# EAGLE design Dock P1RB (EAGLE 8.4.1)
AUTHOR: Simone Mora; CNAME: Tiles Dock; CREVISION: Rev A; DESIGNER: Simone Mora
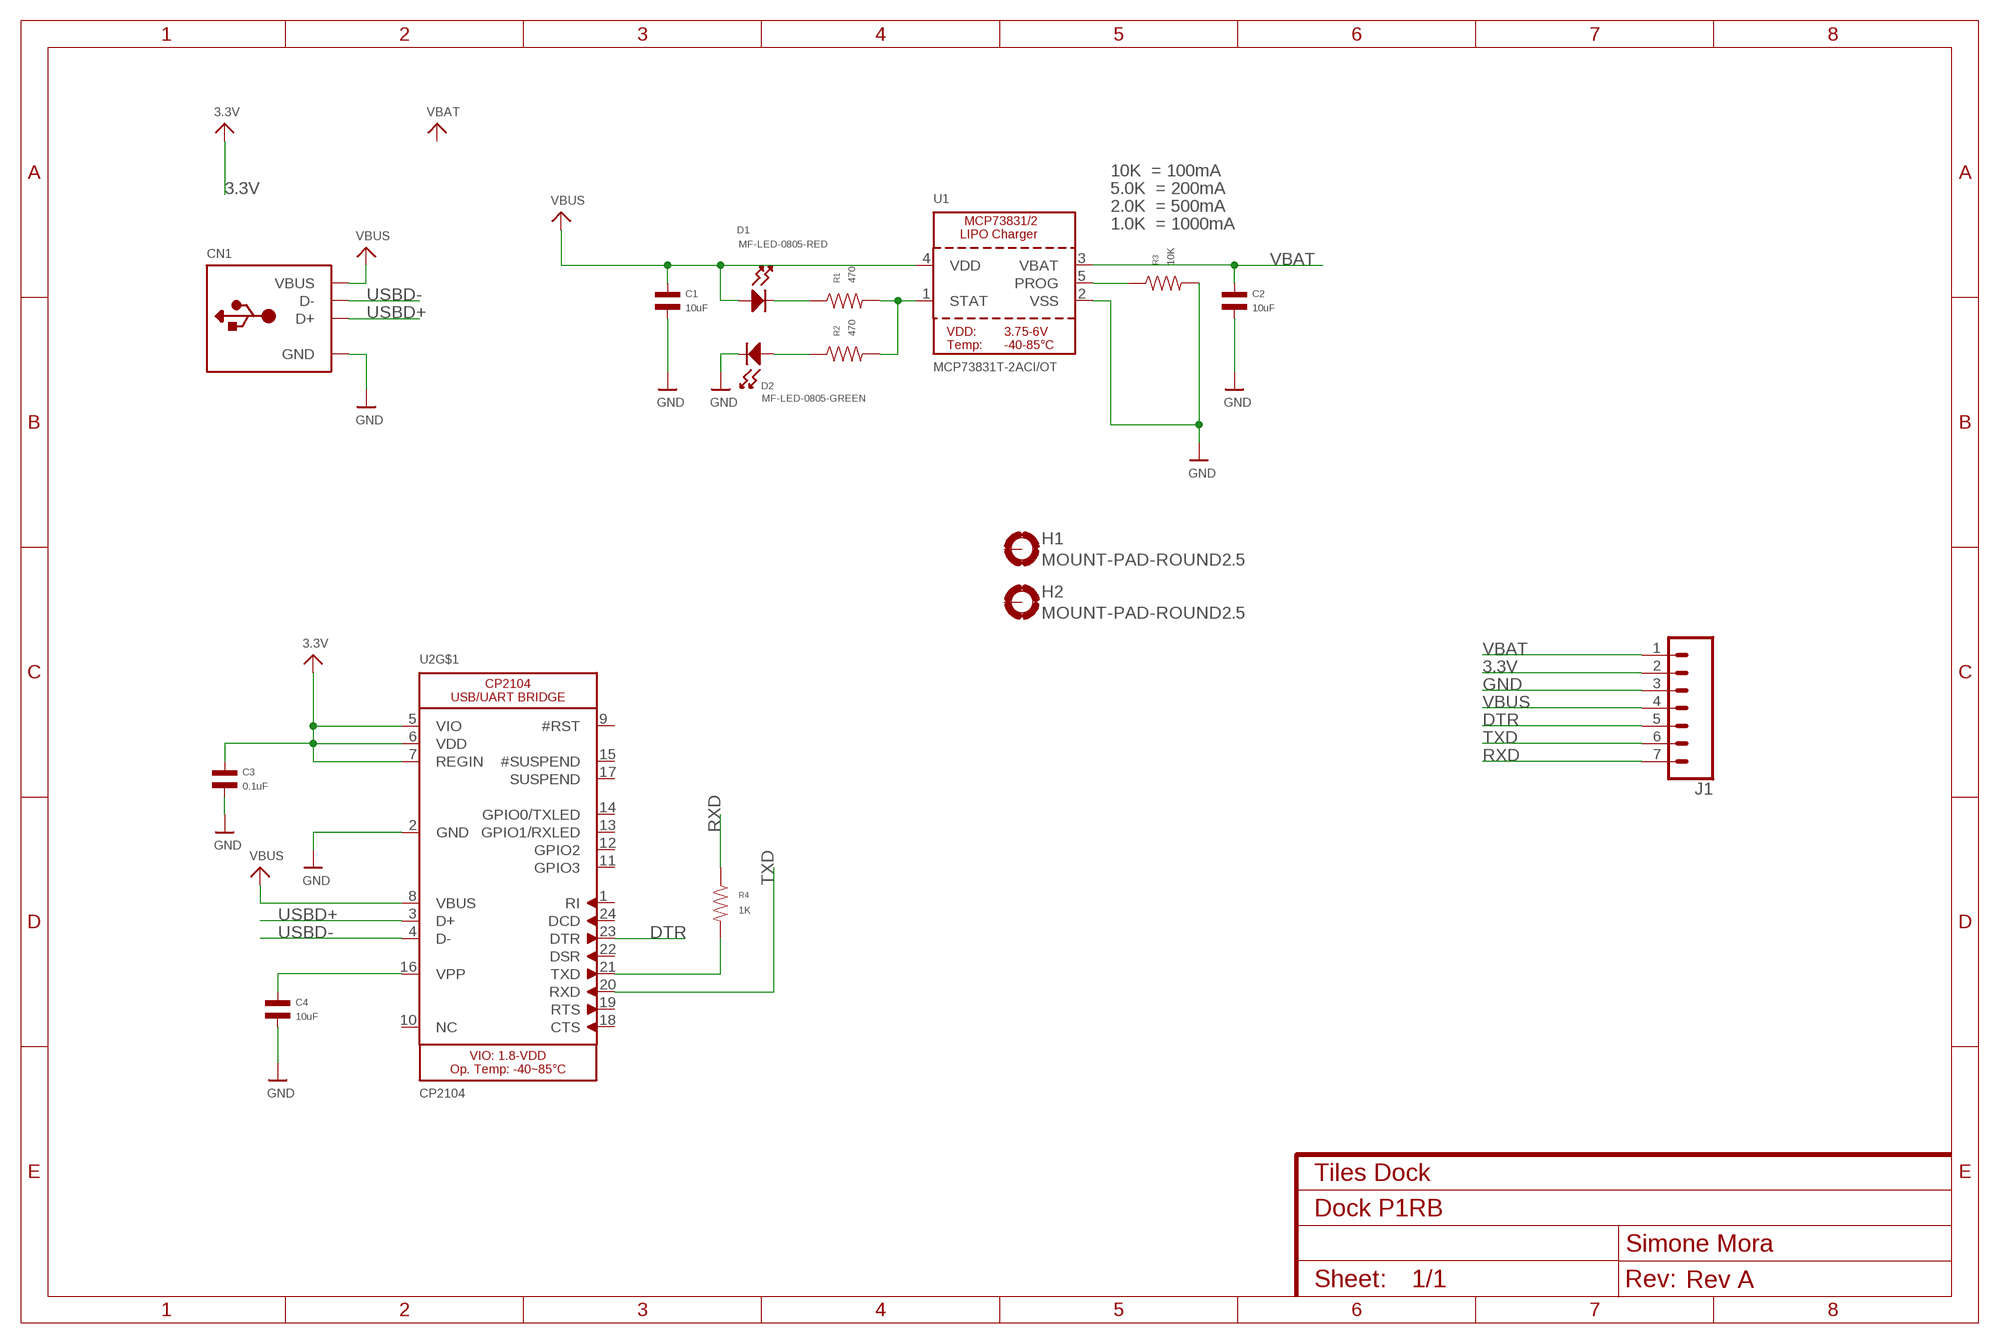
[diagram p0: schematic, sheet 1]

## Parts
C1  10uF  CAPACITOR_NP_1206  [C1206]
C2  10uF  CAPACITOR_NP_1206  [C1206]
C3  0.1uF  CAPACITOR_NP_0603  [C0603]
C4  10uF  CAPACITOR_NP_1206  [C1206]
CN1  USB_TYPEAPCB  [USBA_PCB]
D1  MF-LED-0805-RED  LED_SINGLE-0805-RED  [LED0805]
D2  MF-LED-0805-GREEN  LED_SINGLE-0805-GREEN  [LED0805]
H1  MOUNT-PAD-ROUND2.5  [2,5-PAD-SIM]
H2  MOUNT-PAD-ROUND2.5  [2,5-PAD-SIM]
J1  CONN_07  [1X07]
R1  470  RESISTOR_0603  [R0603]
R2  470  RESISTOR_0603  [R0603]
R3  10K  RESISTOR_0603  [R0603]
R4  1K  RESISTOR_0603  [R0603]
U1  MCP73831T-2ACI/OT  MCP73831/2  [SOT23-5]
U2  CP2104  [QFN24_4MM_SMSC]

## Nets
3.3V: C3.P$1 J1.2 U2.5(VIO) U2.6(VDD) U2.7(REGIN)
DTR: J1.5 U2.23(DTR)
GND: C1.P$2 C2.P$2 C3.P$2 C4.P$2 CN1.GND D2.CATHODE J1.3 R3.P$2 U1.2(VSS) U2.2(GND)
N$1: D1.CATHODE R1.P$1
N$2: R1.P$2 R2.P$2 U1.1(STAT)
N$3: C4.P$1 U2.16(VPP)
N$5: R3.P$1 U1.5(PROG)
N$6: D2.ANODE R2.P$1
N$7: R4.P$2 U2.21(TXD)
RXD: J1.7 R4.P$1
TXD: J1.6 U2.20(RXD)
USBD+: CN1.USB_PLUS(D+) U2.3(D+)
USBD-: CN1.USB_NEG(D-) U2.4(D-)
VBAT: C2.P$1 J1.1 U1.3(VBAT)
VBUS: C1.P$1 CN1.VCC(VBUS) D1.ANODE J1.4 U1.4(VDD) U2.8(VBUS)
Unconnected: H1.B2,8(MOUNT) H2.B2,8(MOUNT) U2.1(RI) U2.9(#RST) U2.10(NC) U2.11(GPIO3) U2.12(GPIO2) U2.13(GPIO1/RXLED) U2.14(GPIO0/TXLED) U2.15(#SUSPEND) U2.17(SUSPEND) U2.18(CTS) U2.19(RTS) U2.22(DSR) U2.24(DCD)

## Notes on the sheet
- 10K  = 100mA
- 5.0K  = 200mA
- 2.0K  = 500mA
- 1.0K  = 1000mA

## Power pins joined to a net without a drawn wire
TP: U2.THERM(TP)

## Library data of the parts
C1 C2 C4 = MF_Passives:CAPACITOR_NP: Library: MF_Passives Description: Device for Non-Polarized Capacitors. Manufacture part number (MPN) can be added via Attributes. Check https://factory.macrofab.com/parts for the house parts list.; HOUSEPART: YES; MPN: MF-CAP-1206-10uF; POPULATE: 1
C3 = MF_Passives:CAPACITOR_NP: Library: MF_Passives Description: Device for Non-Polarized Capacitors. Manufacture part number (MPN) can be added via Attributes. Check https://factory.macrofab.com/parts for the house parts list.; HOUSEPART: YES; MPN: MF-CAP-0603-0.1uF; POPULATE: 1
CN1 = microbuilder:USB_TYPEA: USB - Type A Connectors Male types stick out and are inserted into a PC or matching females parts (these are the connectors used on USB Memory Sticks, etc.). Female parts are generally used for USB Host and accept a male-type connector. SMT Male - 4UCON: 10017 PTH Female - Digikey: 609-1045-ND, 4UCon: 05241
D1 = MF_LEDs:LED_SINGLE: Library: MF_LEDs Description: Device for Single LED Packages. Manufacture part number (MFG#) can be added via Attributes.; HOUSEPART: YES; MPN: MF-LED-0805-RED; POPULATE: 1; URL: https://factory.macrofab.com/part/MF-LED-0805-RED
D2 = MF_LEDs:LED_SINGLE: Library: MF_LEDs Description: Device for Single LED Packages. Manufacture part number (MFG#) can be added via Attributes.; HOUSEPART: YES; MPN: MF-LED-0805-GREEN; POPULATE: 1; URL: https://factory.macrofab.com/part/MF-LED-0805-GREEN
H1 H2 = tiles:MOUNT-PAD-ROUND: MOUNTING PAD, round
J1 = SparkFun-Connectors:CONN_07: Multi connection point. Often used as Generic Header-pin footprint for 0.1 inch spaced/style header connections On any of the 0.1 inch spaced packages, you can populate with these: Break Away Headers - Straight <https://www.sparkfun.com/products/116> (PRT-00116) Break Away Male Headers - Right Angle <https://www.sparkfun.com/products/553> (PRT-00553) Female Headers <https://www.sparkfun.com/products/115> (PRT-00115) Break Away Headers - Machine Pin <https://www.sparkfun.com/products/117> (PRT-00117) Break Away Female Headers - Swiss Machine Pin <https://www.sparkfun.com/products/743> (PRT-00743) For SCREWTERMINALS and SPRING TERMINALS visit here: Screw Terimnals on SparkFun.com <https://www.sparkfun.com/search/results?term=Screw+Terminals> (5mm/3.5mm/2.54mm spacing) This device is also useful as a general connection point to wire up your design to another part of your project. Our various solder wires solder well into these plated through hole pads. Hook-Up Wire - Assortment (Stranded, 22 AWG) <https://www.sparkfun.com/products/11375> (PRT-11375) Hook-Up Wire - Assortment (Solid Core, 22 AWG) <https://www.sparkfun.com/products/11367> (PRT-11367) View the entire wire category on our website here <https://www.sparkfun.com/categories/141> Special notes: Molex polarized connector foot print use with SKU : PRT-08231 with associated crimp pins and housings. 1MM SMD Version SKU: PRT-10208 NOTES ON THE VARIANTS LOCK and LOCK_LONGPADS... This footprint was designed to help hold the alignment of a through-hole component (i.e. 6-pin header) while soldering it into place. You may notice that each hole has been shifted either up or down by 0.005 of an inch from it's more standard position (which is a perfectly straight line). This slight alteration caused the pins (the squares in the middle) to touch the edges of the holes. Because they are alternating, it causes a "brace" to hold the component in place. 0.005 has proven to be the perfect amount of "off-center" position when using our standard breakaway headers. Although looks a little odd when you look at the bare footprint, once you have a header in there, the alteration is very hard to notice. Also,if you push a header all the way into place, it is covered up entirely on the bottom side.
R1 R2 = MF_Passives:RESISTOR: Library: MF_Passives Description: Device for Resistors. Manufacture part number (MPN), Voltage, Tolerance, and Wattage Rating can be added via Attributes. Check https://factory.macrofab.com/parts for the house parts list.; HOUSEPART: YES; MPN: MF-RES-0603-470; POPULATE: 1
R3 = MF_Passives:RESISTOR: Library: MF_Passives Description: Device for Resistors. Manufacture part number (MPN), Voltage, Tolerance, and Wattage Rating can be added via Attributes. Check https://factory.macrofab.com/parts for the house parts list.; HOUSEPART: YES; MPN: MF-RES-0603-10K; POPULATE: 1
R4 = MF_Passives:RESISTOR: Library: MF_Passives Description: Device for Resistors. Manufacture part number (MPN), Voltage, Tolerance, and Wattage Rating can be added via Attributes. Check https://factory.macrofab.com/parts for the house parts list.; HOUSEPART: YES; MPN: MF-RES-0603-1K; POPULATE: 1
U1 = microbuilder:MCP73831/2: MCP73831/2 LIPO Charger VDD: 3.75 - 6V Temp -40 - 85°C Programmable Charge Rate: 15-500mA NOTE: STAT is a tri-state logic output on the MCP73831 and an open-drain output on the MCP73832. SOT23-5 with 4.2V output and tri-state logic on STAT = MCP73831T-2ACI/OT; HOUSEPAR: no; MPN: MCP73831T-2ACI/OT; POPULATE: 1
U2 = microbuilder2:CP2104: CP2104 - USB to UART Bridge VDD Output: 3.45V; HOUSEPART: no; MPN: CP2104; POPULATE: 1

## Board
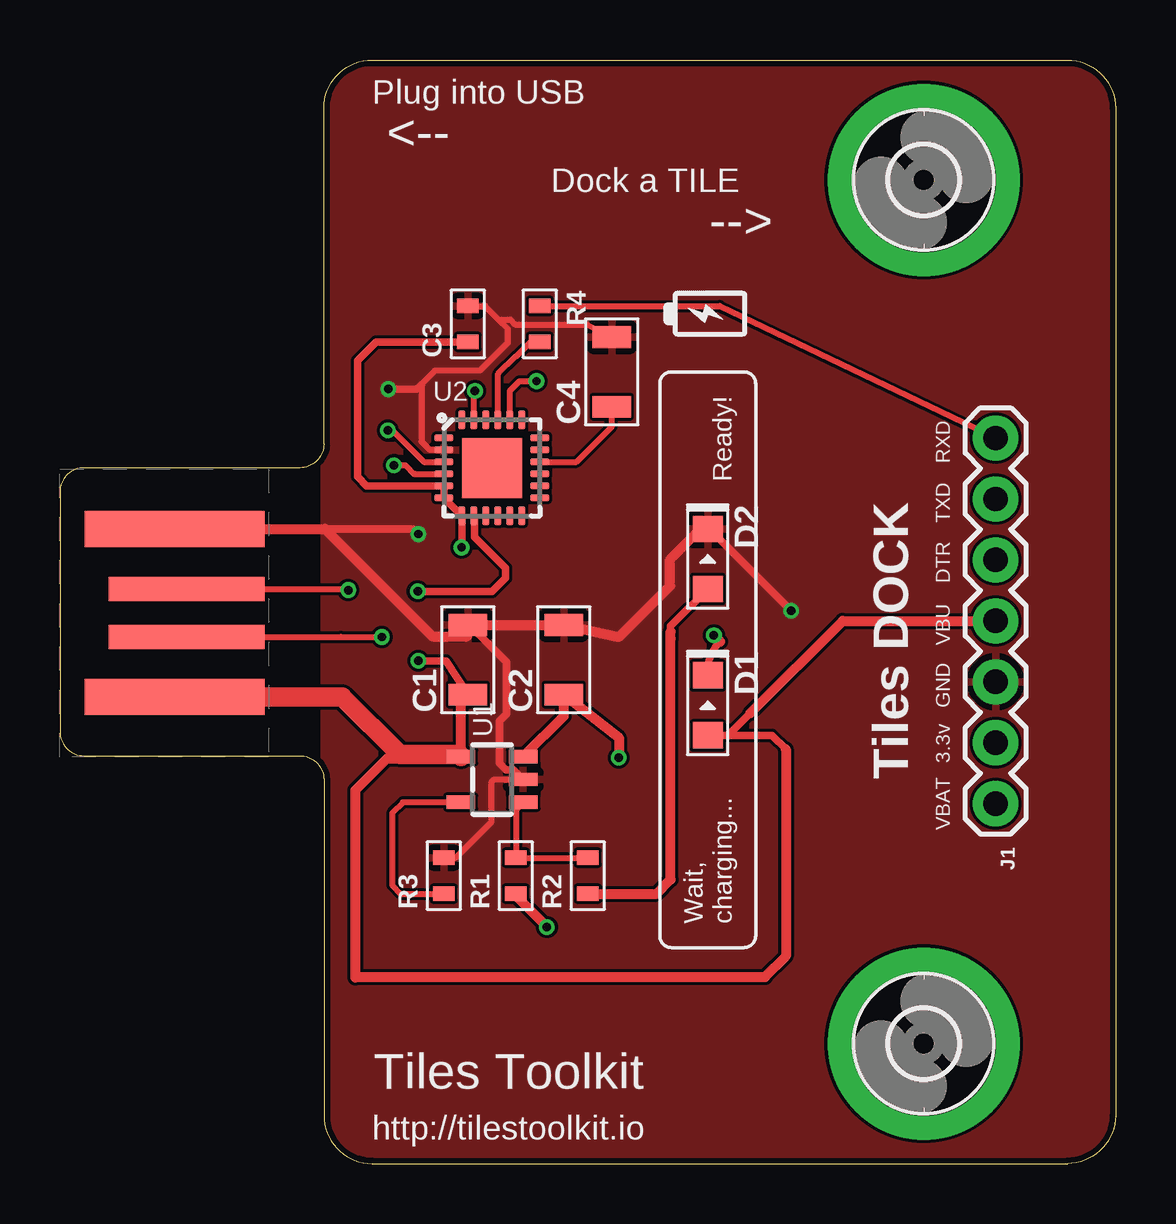
[diagram p1: board, top side]
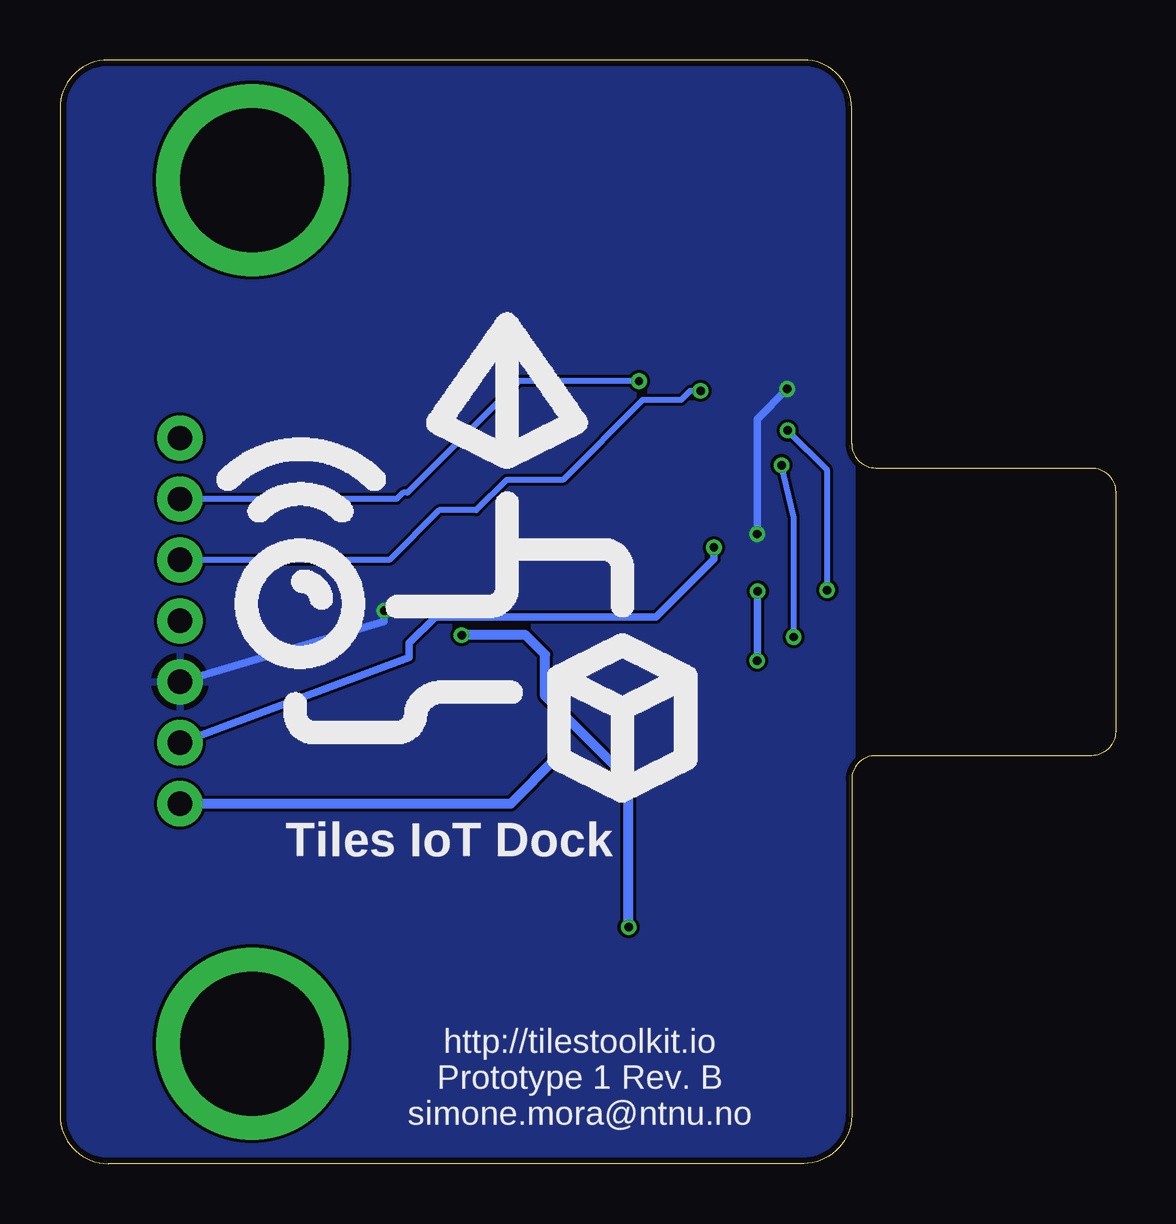
[diagram p2: board, bottom side, seen from below]

Size 44 x 46 mm. Coordinates in mm from the lower left corner, seen from the top.
Outline: 1,17 10,17 arc-90 11,16 11,2 arc90 13,0 42,0 arc90 44,2 44,44 arc90 42,46 13,46 arc90 11,44 11,30 arc-90 10,29 1,29 arc90 0,28 0,18 arc90 1,17
Copper layers (1*16): Top 0.035mm / dielectric 1.5mm / Bottom 0.035mm
Design rules "MF_Standard_2_Layer": minimum track width 5mil, minimum drill 12mil, track to track 5mil, track to pad 5mil, pad to pad 5mil, via to via 5mil, smd to smd 0mil, copper to edge 10mil, drill to drill 10mil, minimum pad ring 6mil, minimum via ring 6mil, stop-mask expansion 2mil, vias tented up to drill 25mil, thermal gap 10mil

### Footprints (pad centres in the part's own frame; a part is rotated, then mirrored left to right if it is on the bottom)
C1206 = smd 0.9 x 1.6: P$1 -1.45,0; P$2 1.45,0
C0603 = smd 0.6 x 0.9: P$1 -0.75,0; P$2 0.75,0
USBA_PCB = smd 7.5 x 1.5: GND -0.2,3.5; VCC -0.2,-3.5 | smd 6.5 x 1: USB_NEG 0.3,-1; USB_PLUS 0.3,1
LED0805 = smd 1.1 x 1.25: ANODE 1.25,0; CATHODE -1.25,0
2,5-PAD-SIM = drill 6 pad 8: B2,8 0,0
1X07 = drill 1.016 pad 1.88: 1 0,0; 2 2.54,0; 3 5.08,0; 4 7.62,0; 5 10.16,0; 6 12.7,0; 7 15.24,0
R0603 = smd 0.6 x 0.9: P$1 -0.75,0; P$2 0.75,0
SOT23-5 = smd 0.55 x 1.2: 1 -0.95,-1.3; 2 0,-1.3; 3 0.95,-1.3; 4 0.95,1.3; 5 -0.95,1.3
QFN24_4MM_SMSC = smd 0.8 x 0.28: 1 -2,1.25; 2 -2,0.75; 3 -2,0.25; 4 -2,-0.25; 5 -2,-0.75; 6 -2,-1.25; 13 2,-1.25; 14 2,-0.75; 15 2,-0.25; 16 2,0.25; 17 2,0.75; 18 2,1.25 | smd 0.28 x 0.8: 7 -1.25,-2; 8 -0.75,-2; 9 -0.25,-2; 10 0.25,-2; 11 0.75,-2; 12 1.25,-2; 19 1.25,2; 20 0.75,2; 21 0.25,2; 22 -0.25,2; 23 -0.75,2; 24 -1.25,2 | smd 2.5 x 2.5: THERM 0,0

### Placement (x,y rotation side)
C1  17,21 90 top
C2  21,21 90 top
C3  17,35 90 top
C4  23,33 90 top
CN1  4.99,22.95 0 top
D1  27,19.1 270 top
D2  27,25.2 270 top
H1  36,41 0 top
H2  36,5 0 top
J1  39,15 90 top
R1  19,12 90 top
R2  22,12 90 top
R3  16,12 90 top
R4  20,35 270 top
U1  18.01,16.01 90 top
U2  18,29 0 top

### Tracks (layer width: path | path; a pad name or v marks a point on that pad's centre or on a via)
3.3V  (via drill 0.35)
  Top 0.305: v16.74,25.68 v16.75,25.69 U2.7 U2.6 U2.5 12.78,28.25 12.4,28.63 12.4,33.48 13.17,34.25 C3.P$1
  Bottom 0.305: J1.2 29.44,21.1 29.44,21.69 28.35,22.78 19.15,22.78 16.74,25.2 v16.74,25.68
DTR  (via drill 0.35)
  Top 0.254: U2.23 17.25,32.16 v17.3,32.21
  Bottom 0.254: v17.3,32.21 17.73,32.21 18.11,31.83 19.71,31.83 23.04,28.5 25.38,28.5 26.65,27.23 28.2,27.23 30.27,25.16 J1.5
GND  (via drill 0.35)
  Top 0.254: R3.P$2 16.48,12.75 17.98,14.25 17.98,15.9 18.09,16.01 U1.2 | C3.P$2 17.72,35.75 18.29,35.18 | 18.29,35.18 18.77,35.18 18.98,34.98 21.97,34.98 C4.P$2 | U2.2 15.42,29.74 15.06,30.1 15.06,32.46 15.06,32.49 15.65,33.07 17.53,33.07 18.67,34.21 18.67,34.8 18.29,35.18
  Top 0.305: v30.48,23.04 27.44,26.08 | U1.2 18.91,16.41 18.59,16.41 18.32,16.68 18.32,18.44 18.62,18.75 18.62,20.91 17.57,21.95 C1.P$2 | 11.04,26.45 14.73,26.45 v14.94,26.24 | v13.69,32.28 14.89,32.28 15.06,32.46
  Top 0.406: CN1.GND 11.04,26.45 15.52,21.97 16.98,21.97 C1.P$2 C2.P$2 23.3,21.95 25.43,24.08 25.43,25.17 26.52,26.26
  Bottom 0.305: J1.3 30.48,22.6 v30.48,23.04 | v14.94,26.24 14.94,31.04 v13.69,32.28
  pour Top: 11,46 44,46 44,0 11,0
  pour Bottom: 11,46 44,46 44,0 11,0
N$1  (via drill 0.35)
  Top 0.305: D1.CATHODE 27,20.5 arc-45 27.52,21.76
  Top 0.406: R1.P$1 19,11.15 v20.3,9.86 | 27.52,21.76 v27.26,22.02
  Bottom 0.406: v20.3,9.86 20.3,16 23.78,19.48 23.78,21.21 24.59,22.02 v27.26,22.02
N$2
  Top 0.254: U1.1 19,14.75 R1.P$2 R2.P$2
N$3
  Top 0.254: U2.16 21.53,29.25 23,30.72 C4.P$1
N$5
  Top 0.254: U1.5 14.3,15.06 13.85,14.61 13.85,11.61 14.2,11.25 R3.P$1
N$6
  Top 0.305: 25.45,21.87 25.45,22.4 D2.ANODE
  Top 0.406: R2.P$1 24.87,11.25 25.45,11.84 25.45,21.87 25.45,22.17
N$7
  Top 0.254: U2.21 18.26,31.01 18.26,32.92 19,33.66 19.03,33.66 19.62,34.25 R4.P$2
RXD
  Top 0.254: R4.P$1 27.49,35.75 J1.7
TXD  (via drill 0.35)
  Top 0.254: U2.20 18.75,32.21 19.15,32.61 v19.87,32.61
  Bottom 0.254: v19.87,32.61 24.87,32.61 29.52,27.97 29.69,27.97 29.96,27.7 J1.6
USBD+  (via drill 0.35)
  Top 0.254: CN1.USB_PLUS 11.97,23.95 v12.02,23.9 | v13.67,30.56 13.87,30.56 15.18,29.25 U2.3
  Bottom 0.254: v12.02,23.9 12.02,28.91 v13.67,30.56
USBD-  (via drill 0.35)
  Top 0.254: CN1.USB_NEG 11.71,21.95 v13.41,21.95 | v13.92,29.11 14.4,29.11 14.79,28.73 14.81,28.75 U2.4
  Bottom 0.254: v13.41,21.95 13.41,26.93 v13.92,29.11
VBAT  (via drill 0.35)
  Top 0.406: U1.3 21,18.65 C2.P$1 23.29,17.76 v23.29,16.92
  Bottom 0.406: v23.29,16.92 25.21,15 J1.1
VBUS  (via drill 0.35)
  Top 0.305: 14.01,16.88 14.18,17.04 | C1.P$1 16.09,20.96 v14.94,20.96 | v14.91,23.85 18.01,23.85 18.57,24.41 18.57,24.82 17.27,26.11 17.27,26.98 U2.8 | 27.02,17.85 D1.ANODE | D1.ANODE 27.85,17.85 28.76,18.76 | D1.ANODE 29.68,17.85 30.25,17.27
  Top 0.406: U1.4 16.71,19.76 C1.P$1 | 30.25,17.27 30.25,8.64 29.39,7.77 12.35,7.77 12.32,7.75 12.32,15.57 13.63,16.88 14.01,16.88 | 28.76,18.76 28.78,18.77 32.63,22.62 J1.4
  Top 0.813: CN1.VCC 11.77,19.45 14.18,17.04 16.63,17.04 U1.4
  Bottom 0.305: v14.94,20.96 14.94,23.83 v14.91,23.85

### Text on the board
tPlace: Plug into USB | <-- | Dock a TILE | --> | Ready! | RXD | TXD | DTR | Tiles DOCK | VBU | GND | 3.3v | VBAT | Wait, / charging... | Tiles Toolkit | http://tilestoolkit.io
bPlace: Tiles IoT Dock | http://tilestoolkit.io / Prototype 1 Rev. B / simone.mora@ntnu.no